# Altium project lab1.PrjPcb
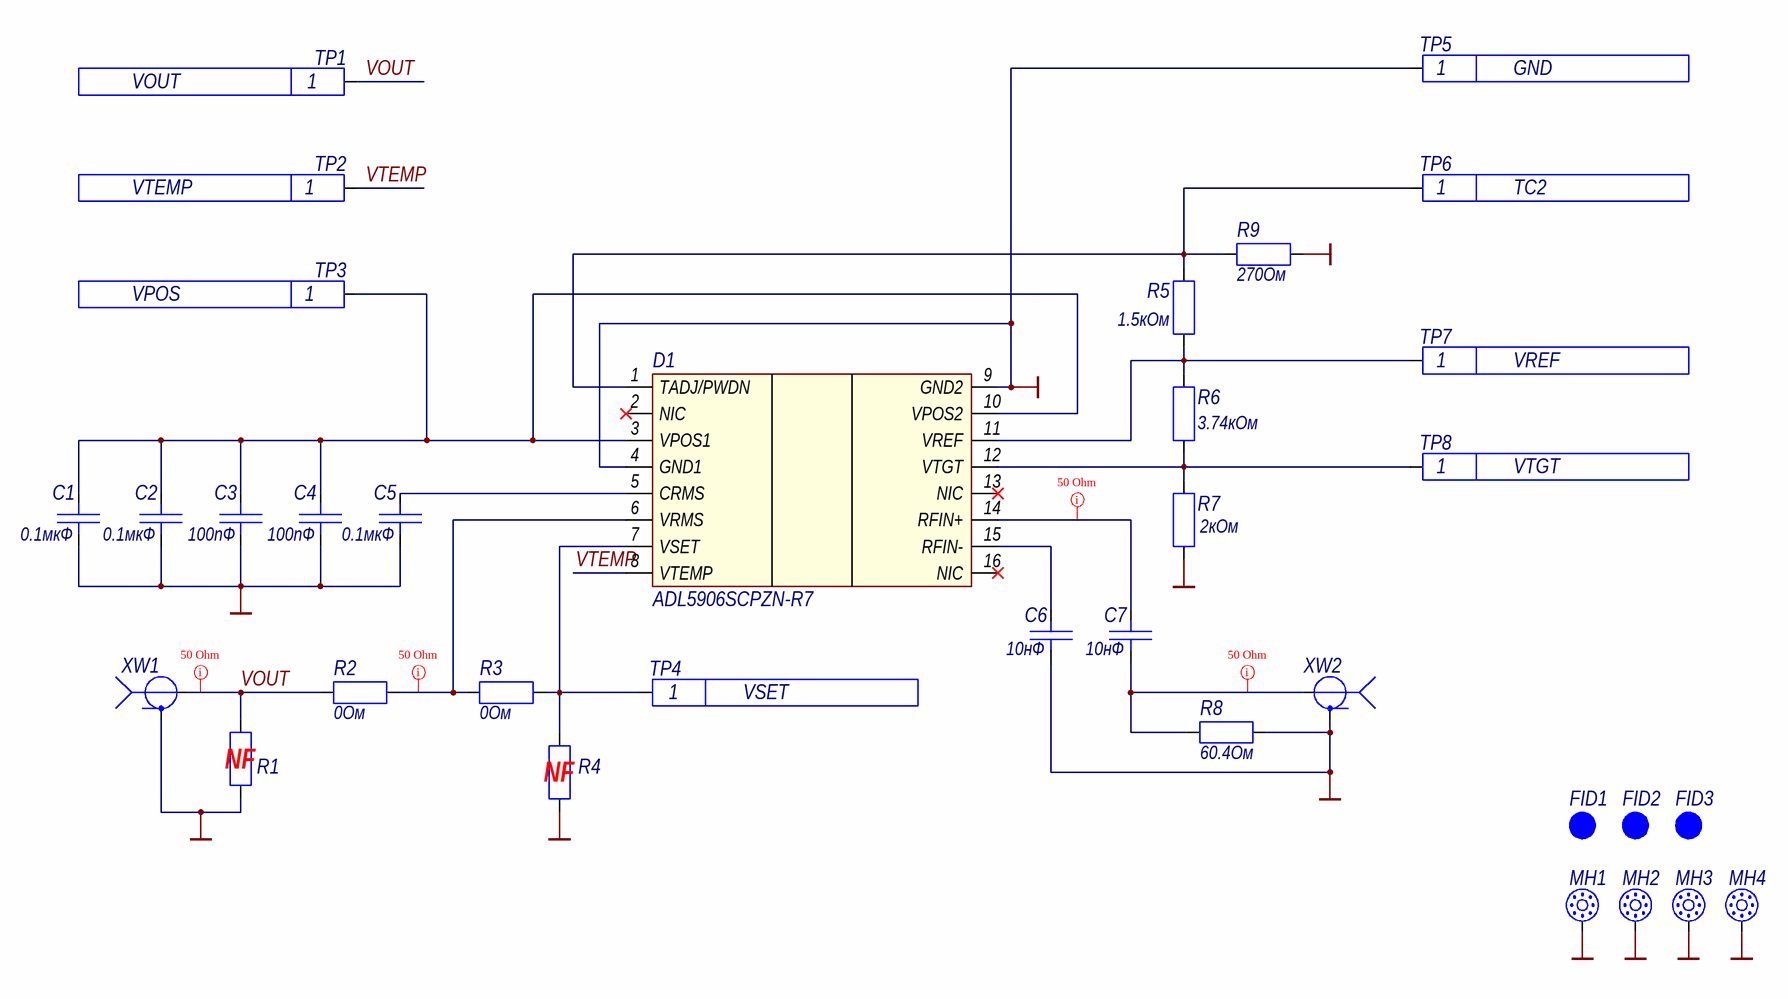
[diagram p0: lab1.SchDoc]
п_Утв_Р: Адаменко І.О.; п_Разраб_Р: ГеращенкоА.Ю.; п_Пров_Р: Адаменко І.О.; Обозначение_Код: ДК31мп.464979.001Е3; Обозначение: ДК31мп.464979.001Е3; Наименование2: ADL5906-EVALZ-ND; Наименование1: Оціночний набір; Наименование: Оціночний набір ADL5906-EVALZ-ND; Вид_документа_SCH: Схема електрична принципова; Вид_документа: Схема електрична принципова
1 sheet, 34 parts. Net scope: global (net labels, ports and power ports of the same name join across sheets).
Board file: lab1.PcbDoc

## Sheet lab1.SchDoc: Схема електрична принципова
size 420 x 297 mm; Organization: ФЕЛ, КЕОА; SheetNumber: 1; SheetTotal: 1

### Parts
C1  value 0.1мкФ  [CAP_0603_0.1uF]  (hidden comment: CAP_0603_0.1uF)
C2  value 0.1мкФ  [CAP_0603_0.1uF]  (hidden comment: CAP_0603_0.1uF)
C3  value 100пФ  [CAP_0603_100pF]  (hidden comment: CAP_0603_100pF)
C4  value 100пФ  [CAP_0603_100pF]  (hidden comment: CAP_0603_100pF)
C5  value 0.1мкФ  [CAP_0603_0.1uF]  (hidden comment: CAP_0603_0.1uF)
C6  value 10нФ  [CAP_0603_10nF]  (hidden comment: CAP_0603_10nF)
C7  value 10нФ  [CAP_0603_10nF]  (hidden comment: CAP_0603_10nF)
D1  ADL5906SCPZN-R7  [ADL5906SCPZN-R7]
FID1  Fiducial  [FIDUCIAL 1mm]  (value not drawn)  (no BOM)
FID2  Fiducial  [FIDUCIAL 1mm]  (value not drawn)  (no BOM)
FID3  Fiducial  [FIDUCIAL 1mm]  (value not drawn)  (no BOM)
MH1  Mounting Hole M3  [Mounting Hole M3]  (value not drawn)
MH2  Mounting Hole M3  [Mounting Hole M3]  (value not drawn)
MH3  Mounting Hole M3  [Mounting Hole M3]  (value not drawn)
MH4  Mounting Hole M3  [Mounting Hole M3]  (value not drawn)
R1  RES_0603 0Ohm  [RES_0603 0Ohm]  (value not drawn)
R2  value 0Ом  [RES_0603 0Ohm]  (hidden comment: RES_0603 0Ohm)
R3  value 0Ом  [RES_0603 0Ohm]  (hidden comment: RES_0603 0Ohm)
R4  RES_0603 0Ohm  [RES_0603 0Ohm]  (value not drawn)
R5  value 1.5кОм  [RES_0603 1.5kOhm]  (hidden comment: RES_0603 1.5kOhm)
R6  value 3.74кОм  [RES_0603 3.74kOhm]  (hidden comment: RES_0603 3.74kOhm)
R7  value 2кОм  [RES_0603 2kOhm]  (hidden comment: RES_0603 2kOhm)
R8  value 60.4Ом  [RES_0603 60.4Ohm]  (hidden comment: RES_0603 60.4Ohm)
R9  value 270Ом  [RES_0603 270Ohm]  (hidden comment: RES_0603 270Ohm)
TP1  Test point  [TEST POINT BLACK]  (value not drawn)  (no BOM)
TP2  Test point  [TEST POINT BLACK]  (value not drawn)  (no BOM)
TP3  Test point  [TEST POINT ORANGE]  (value not drawn)  (no BOM)
TP4  Test point  [TEST POINT BLACK]  (value not drawn)  (no BOM)
TP5  Test point  [TEST POINT BLACK]  (value not drawn)  (no BOM)
TP6  Test point  [TEST POINT BLACK]  (value not drawn)  (no BOM)
TP7  Test point  [TEST POINT BLACK]  (value not drawn)  (no BOM)
TP8  Test point  [TEST POINT BLACK]  (value not drawn)  (no BOM)
XW1  EMPCB.SMAFSTJ.B.HT  [EMPCB.SMAFSTJ.B.HT]  (value not drawn)
XW2  EMPCB.SMAFSTJ.B.HT  [EMPCB.SMAFSTJ.B.HT]  (value not drawn)

### Nets
GND: C1.1 C2.1 C3.1 C4.1 C5.1 C6.1 D1.4(GND1) D1.9(GND2) MH1.1 MH2.1 MH3.1 MH4.1 R1.1 R4.1 R7.2 R8.2 R9.1 TP5.1 XW1.2 XW2.2
VOUT: R1.2 R2.1 TP1.1 XW1.1
VTEMP: D1.8(VTEMP) TP2.1
NetC1_2: C1.2 C2.2 C3.2 C4.2 D1.3(VPOS1) D1.10(VPOS2) TP3.1
NetC5_2: C5.2 D1.5(CRMS)
NetC6_2: C6.2 D1.15(RFIN-)
NetC7_1: C7.1 R8.1 XW2.1
NetC7_2: C7.2 D1.14(RFIN+)
NetD1_1: D1.1(TADJ/PWDN) R5.2 R9.2 TP6.1
NetD1_6: D1.6(VRMS) R2.2 R3.1
NetD1_7: D1.7(VSET) R3.2 R4.2 TP4.1
NetD1_11: D1.11(VREF) R5.1 R6.2 TP7.1
NetD1_12: D1.12(VTGT) R6.1 R7.1 TP8.1

Not connected (* = marked no-connect by the designer): D1 2(NIC)* 13(NIC)* 16(NIC)*

### Layout directives
net class 50 Ohm: NetC7_1, NetC7_2, NetD1_6, VOUT

### Notes on the sheet
- VOUT
- (near TP1) 1
- (near TP5) 1
- GND
- VTEMP
- (near TP2) 1
- (near TP6) 1
- TC2
- VPOS
- (near TP3) 1
- (near TP7) 1
- VREF
- (near TP8) 1
- VTGT
- (near TP4) 1
- VSET
- (near R1) NF
- (near R4) NF
- Перв. застосув.
- Справ. №
- Підп. дата
- Інв. № дубл.
- Взам. інв. №
- Підп. та дата
- Зм.
- Розроб.
- Арк.
- № докум.
- Підп.
- Дата
- Літ.
- Маса
- Маштаб
- 1:1
- Перев.
- Аркушів
- Інв. № подл.
- Н.контр.
- Затв.
- КПІ ім. Ігоря Сікорського
- ALTIUM GOSTBOM2.0 KEV
- Копіював
- Формат А3

### Library data of the parts
C1 C2 C5 = CAP_0603_0.1uF: C0603C104K5RAC7867; Manufacturer: KEMET; Part Number: 399-C0603C104K5RAC7867DKR-ND; Tolerance: ±10%; Voltage: 50В; Type: Конденсатор керамічний; Dielectric: X7R; Package: 0603; Mount: SMT; Min Operating Temperature: -55; Max Operating Temperature: 125; Number of Pins: 2
C3 C4 = CAP_0603_100pF: C0603C101K5GAC7867; Manufacturer: KEMET; Part Number: 399-C0603C101K5GAC7867DKR-ND; Tolerance: ±10%; Voltage: 50В; Type: Конденсатор керамічний; Dielectric: X7R; Package: 0603; Mount: SMT; Min Operating Temperature: -55; Max Operating Temperature: 125; Number of Pins: 2
C6 C7 = CAP_0603_10nF: C0603C103K5RAC7867; Manufacturer: KEMET; Part Number: 399-C0603C103K5RAC7867DKR-ND; Tolerance: ±10%; Voltage: 50В; Type: Конденсатор керамічний; Dielectric: X7R; Package: 0603; Mount: SMT; Min Operating Temperature: -55; Max Operating Temperature: 125; Number of Pins: 2
D1 = ADL5906SCPZN-R7: IC RF DETECT 10MHZ-10GHZ 16CSP; Manufacturer: Analog Devices Inc.; Package: 16-WQFN Exposed Pad; Mount: SMT; Type: *; Min Operating Temperature: 0°C; Max Operating Temperature: +85°C; Number of Pins: 16; Part Number: ADL5906SCPZN-R7
FID1-FID3 = FIDUCIAL 1mm: Fiducial 1mm Pad; Value: Fiducial; Component Function: *
R1 R4 = RES_0603 0Ohm: RES 0 OHM JUMPER 1/10W 0603; Manufacturer: Stackpole Electronics Inc; Part Number: RMCF0603ZT0R00DKR-ND; Value: 0Ом; Tolerance: ±1%; Power Rating: 1/10 Вт; Package: 0603; Type: Резистор; Mount: SMT; Min Operating Temperature: -55°C; Max Operating Temperature: +155°C; Number of Pins: 2
R2 R3 = RES_0603 0Ohm: RES 0 OHM JUMPER 1/10W 0603; Manufacturer: Stackpole Electronics Inc; Part Number: RMCF0603ZT0R00DKR-ND; Tolerance: ±1%; Power Rating: 1/10 Вт; Package: 0603; Type: Резистор; Mount: SMT; Min Operating Temperature: -55°C; Max Operating Temperature: +155°C; Number of Pins: 2
R5 = RES_0603 1.5kOhm: RES 1.5K OHM 1% 1/10W 0603; Manufacturer: Stackpole Electronics Inc; Part Number: RMCF0603FT1K50DKR-ND; Power Rating: 1/10 Вт; Package: 0603; Tolerance: ±1%; Type: Резистор; Mount: SMT; Min Operating Temperature: -55°C; Max Operating Temperature: +155°C; Number of Pins: 2
R6 = RES_0603 3.74kOhm: RES 3.74K OHM 1% 1/10W 0603; Manufacturer: Stackpole Electronics Inc; Part Number: RMCF0603FT60R4DKR-ND; Power Rating: 1/10 Вт; Package: 0603; Tolerance: ±1%; Type: Резистор; Mount: SMT; Min Operating Temperature: -55°C; Max Operating Temperature: +155°C; Number of Pins: 2
R7 = RES_0603 2kOhm: RES 2K OHM 1% 1/10W 0603; Manufacturer: Stackpole Electronics Inc; Part Number: RMCF0603FT2K00DKR-ND; Power Rating: 1/10 Вт; Package: 0603; Tolerance: ±1%; Type: Резистор; Mount: SMT; Min Operating Temperature: -55°C; Max Operating Temperature: +155°C; Number of Pins: 2
R8 = RES_0603 60.4Ohm: RES 60.4 OHM 1% 1/10W 0603; Manufacturer: Stackpole Electronics Inc; Part Number: RMCF0603FT60R4DKR-ND; Power Rating: 1/10 Вт; Package: 0603; Tolerance: ±1%; Type: Резистор; Mount: SMT; Min Operating Temperature: -55°C; Max Operating Temperature: +155°C; Number of Pins: 2
R9 = RES_0603 270Ohm: RES 270 OHM 1% 1/10W 0603; Manufacturer: Stackpole Electronics Inc; Part Number: RMCF0603FT270RDKR-ND; Power Rating: 1/10 Вт; Package: 0603; Tolerance: ±1%; Type: Резистор; Mount: SMT; Min Operating Temperature: -55°C; Max Operating Temperature: +155°C; Number of Pins: 2
TP1 TP2 TP4-TP8 = TEST POINT BLACK: PC TEST POINT MINIATURE BLACK; Value: Test point; Component Function: *
TP3 = TEST POINT ORANGE: PC TEST POINT MINIATURE ORANGE; Value: Test point; Component Function: *
XW1 XW2 = EMPCB.SMAFSTJ.B.HT: 50 Ω, side launch SMA connectors; Manufacturer: Taoglas Limited; Part Number: EMPCB.SMAFSTJ.B.HT; Number of Pins: 2; Mount: SMT; Min Operating Temperature: -40°C; Max Operating Temperature: +85°C; Mated With: *; Type: Female Socket